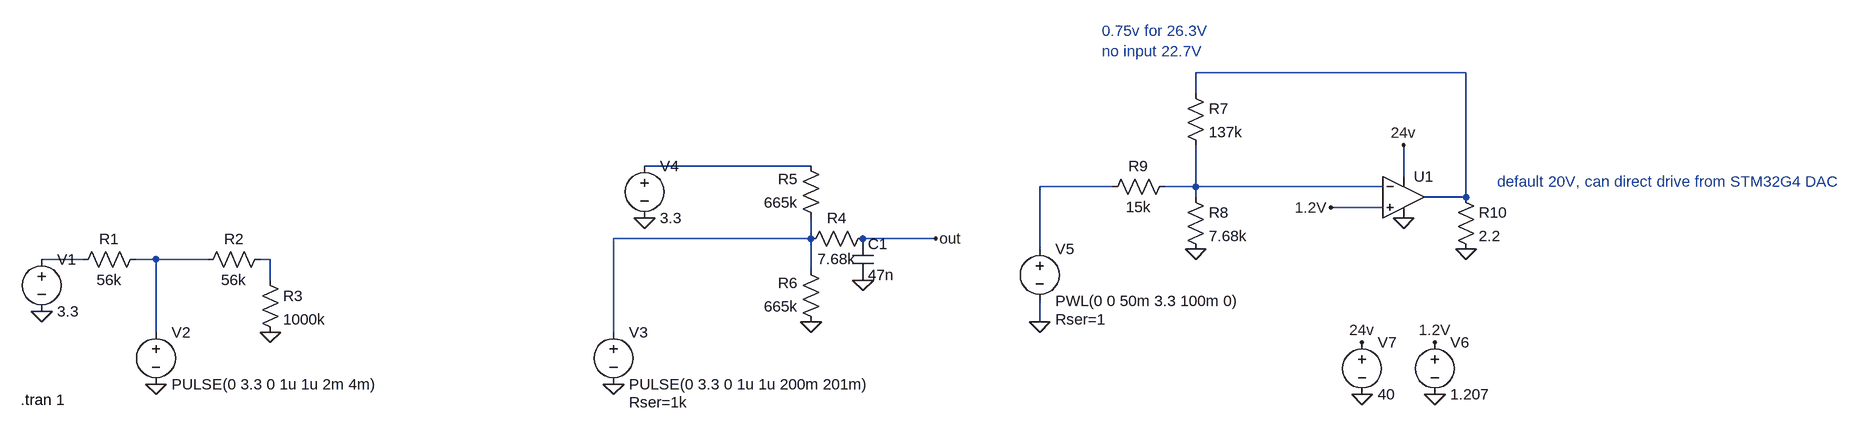
[diagram p0: schematic mcuinterface.asc]
mcuinterface.asc, the LTspice schematic file:
Version 4
SHEET 1 2916 680
WIRE 2304 -128 1888 -128
WIRE 1888 -96 1888 -128
WIRE 1296 16 1040 16
WIRE 2208 32 2208 -16
WIRE 1760 48 1648 48
WIRE 1888 48 1888 -16
WIRE 1888 48 1840 48
WIRE 2176 48 1888 48
WIRE 1888 64 1888 48
WIRE 2304 64 2304 -128
WIRE 2304 64 2240 64
WIRE 2176 80 2096 80
WIRE 1296 128 1296 96
WIRE 1296 128 992 128
WIRE 1488 128 1376 128
WIRE 1648 144 1648 48
WIRE 176 160 112 160
WIRE 288 160 256 160
WIRE 368 160 288 160
WIRE 464 160 448 160
WIRE 1296 176 1296 128
WIRE 464 192 464 160
WIRE 1648 256 1648 224
WIRE 288 272 288 160
WIRE 992 272 992 128
FLAG 112 240 0
FLAG 288 352 0
FLAG 464 272 0
FLAG 1296 256 0
FLAG 1040 96 0
FLAG 1376 192 0
FLAG 992 352 0
FLAG 1488 128 out
FLAG 2208 96 0
FLAG 2096 80 1.2V
FLAG 2208 -16 24v
FLAG 1888 144 0
FLAG 1648 256 0
FLAG 2256 368 0
FLAG 2256 288 1.2V
FLAG 2144 368 0
FLAG 2144 288 24v
FLAG 2304 144 0
SYMBOL voltage 112 144 R0
WINDOW 123 0 0 Left 0
WINDOW 39 0 0 Left 0
SYMATTR InstName V1
SYMATTR Value 3.3
SYMBOL voltage 288 256 R0
WINDOW 123 0 0 Left 0
WINDOW 39 0 0 Left 0
SYMATTR InstName V2
SYMATTR Value PULSE(0 3.3 0 1u 1u 2m 4m)
SYMBOL res 272 144 R90
WINDOW 0 0 56 VBottom 2
WINDOW 3 32 56 VTop 2
SYMATTR InstName R1
SYMATTR Value 56k
SYMBOL res 464 144 R90
WINDOW 0 0 56 VBottom 2
WINDOW 3 32 56 VTop 2
SYMATTR InstName R2
SYMATTR Value 56k
SYMBOL res 448 176 R0
SYMATTR InstName R3
SYMATTR Value 1000k
SYMBOL voltage 992 256 R0
WINDOW 123 0 0 Left 0
WINDOW 39 24 124 Left 2
SYMATTR SpiceLine Rser=1k
SYMATTR InstName V3
SYMATTR Value PULSE(0 3.3 0 1u 1u 200m 201m)
SYMBOL res 1392 112 R90
WINDOW 0 0 56 VBottom 2
WINDOW 3 32 56 VTop 2
SYMATTR InstName R4
SYMATTR Value 7.68k
SYMBOL res 1312 112 R180
WINDOW 0 36 76 Left 2
WINDOW 3 36 40 Left 2
SYMATTR InstName R5
SYMATTR Value 665k
SYMBOL res 1312 272 R180
WINDOW 0 36 76 Left 2
WINDOW 3 36 40 Left 2
SYMATTR InstName R6
SYMATTR Value 665k
SYMBOL voltage 1040 0 R0
WINDOW 123 0 0 Left 0
WINDOW 39 0 0 Left 0
SYMATTR InstName V4
SYMATTR Value 3.3
SYMBOL cap 1360 128 R0
SYMATTR InstName C1
SYMATTR Value 47n
SYMBOL OpAmps\\UniversalOpAmp 2208 64 R0
SYMATTR InstName U1
SYMBOL res 1872 -112 R0
SYMATTR InstName R7
SYMATTR Value 137k
SYMBOL res 1872 48 R0
SYMATTR InstName R8
SYMATTR Value 7.68k
SYMBOL voltage 1648 128 R0
WINDOW 123 0 0 Left 0
WINDOW 39 24 124 Left 2
SYMATTR SpiceLine Rser=1
SYMATTR InstName V5
SYMATTR Value PWL(0 0 50m 3.3 100m 0)
SYMBOL res 1856 32 R90
WINDOW 0 0 56 VBottom 2
WINDOW 3 32 56 VTop 2
SYMATTR InstName R9
SYMATTR Value 15k
SYMBOL voltage 2256 272 R0
WINDOW 123 0 0 Left 0
WINDOW 39 0 0 Left 0
SYMATTR InstName V6
SYMATTR Value 1.207
SYMBOL voltage 2144 272 R0
WINDOW 123 0 0 Left 0
WINDOW 39 0 0 Left 0
SYMATTR InstName V7
SYMATTR Value 40
SYMBOL res 2288 48 R0
SYMATTR InstName R10
SYMATTR Value 2.2
TEXT 80 376 Left 2 !.tran 1
TEXT 2352 40 Left 2 ;default 20V, can direct drive from STM32G4 DAC
TEXT 1744 -192 Left 2 ;0.75v for 26.3V\nno input 22.7V

The netlist it stands for:
* mcuinterface.asc
V1 N006 0 3.3
V2 N007 0 PULSE(0 3.3 0 1u 1u 2m 4m)
R1 N007 N006 56k
R2 N008 N007 56k
R3 N008 0 1000k
V3 N005 0 PULSE(0 3.3 0 1u 1u 200m 201m) Rser=1k
R4 out N005 7.68k
R5 N005 N002 665k
R6 0 N005 665k
V4 N002 0 3.3
C1 out 0 47n
XU1 1.2V N004 24v 0 N001 level1 Avol=1Meg GBW=10Meg Vos=0 En=0 Enk=0 In=0 Ink=0 Rin=500Meg  ; pins In+ In- V+ V- OUT
R7 N001 N004 137k
R8 N004 0 7.68k
V5 N003 0 PWL(0 0 50m 3.3 100m 0) Rser=1
R9 N004 N003 15k
V6 1.2V 0 1.207
V7 24v 0 40
R10 N001 0 2.2
.tran 1
* default 20V, can direct drive from STM32G4 DAC
* 0.75v for 26.3V
* no input 22.7V
.lib UniversalOpAmp1.lib
.backanno
.end